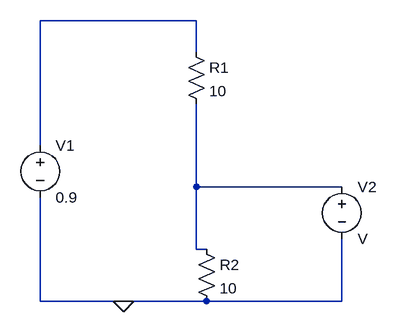
[diagram p0: schematic voltagedivider.asc]
voltagedivider.asc, the LTspice schematic file:
Version 4
SHEET 1 880 680
WIRE 208 -144 -32 -144
WIRE 208 -96 208 -144
WIRE -32 48 -32 -144
WIRE 208 112 208 -16
WIRE 432 112 208 112
WIRE 208 208 208 112
WIRE 224 208 208 208
WIRE -32 288 -32 128
WIRE 96 288 -32 288
WIRE 224 288 96 288
WIRE 432 288 432 192
WIRE 432 288 224 288
FLAG 96 288 0
SYMBOL voltage -32 32 R0
WINDOW 123 0 0 Left 0
WINDOW 39 0 0 Left 0
SYMATTR InstName V1
SYMATTR Value 0.9
SYMBOL res 192 -112 R0
SYMATTR InstName R1
SYMATTR Value 10
SYMBOL res 208 192 R0
SYMATTR InstName R2
SYMATTR Value 10
SYMBOL voltage 432 96 R0
SYMATTR InstName V2

The netlist it stands for:
* voltagedivider.asc
V1 N001 0 0.9
R1 N001 N002 10
R2 N002 0 10
V2 N002 0 V
.backanno
.end